# Altium schematic sheet communication.SchDoc
size A3; DocumentNumber: 2; SheetNumber: 2; SheetTotal: 45; SheetDescription: Communication
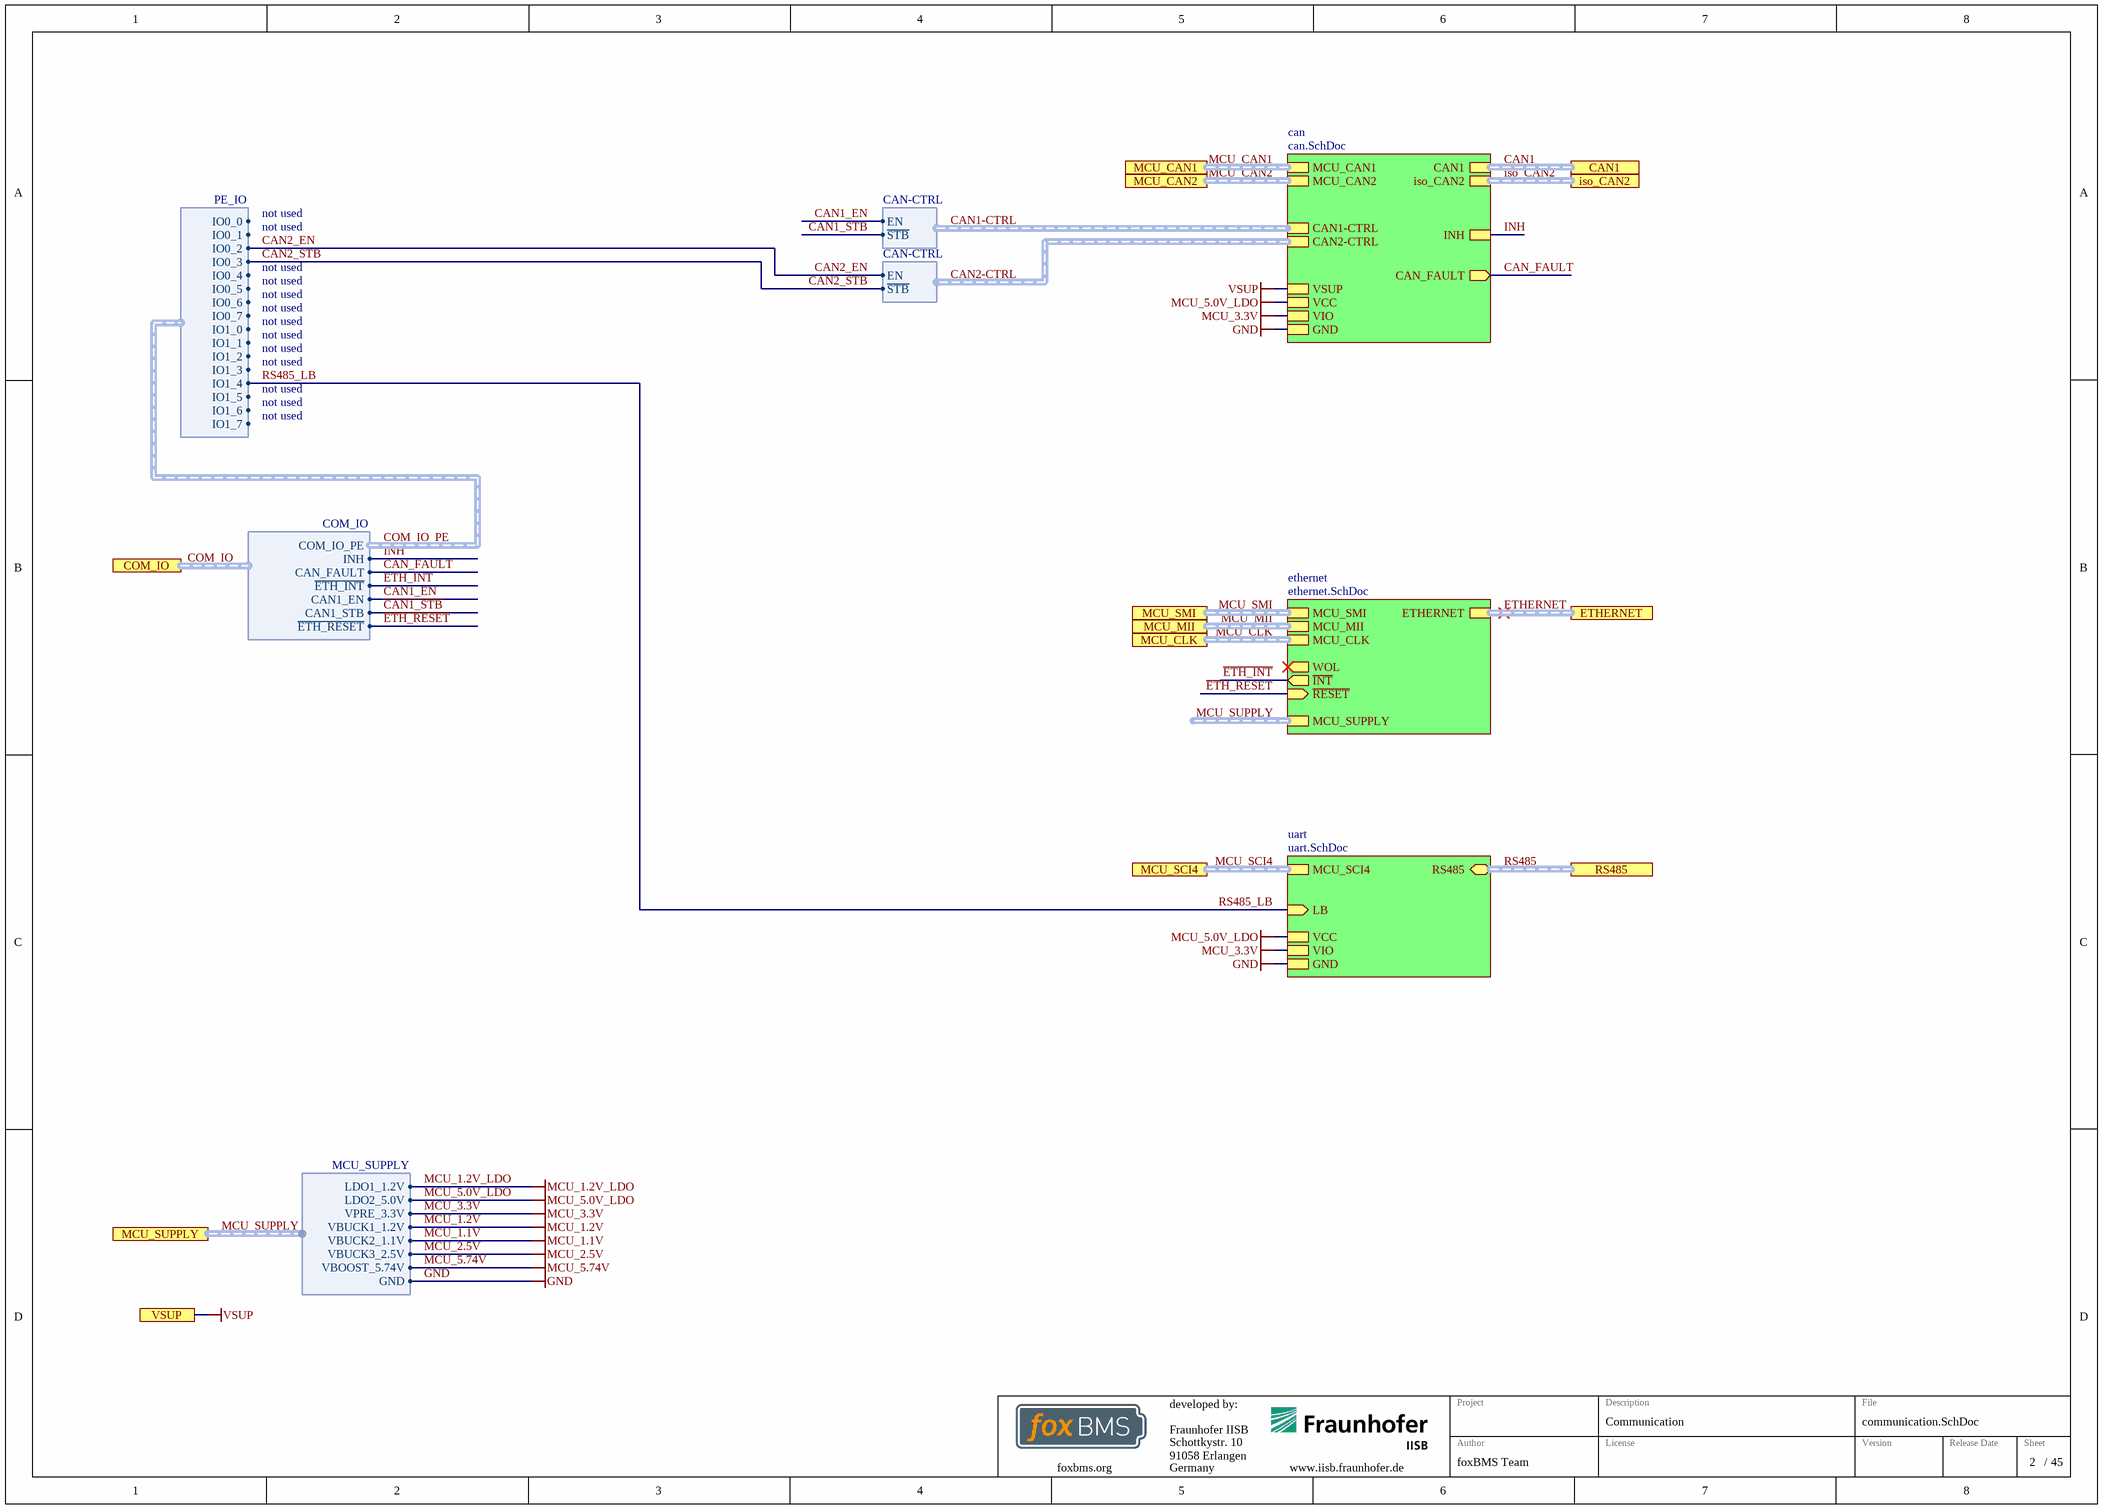
[diagram p0: communication.SchDoc]

## Sub-sheets
can = can.SchDoc: MCU_CAN1 (harness MCU_CAN), CAN2-CTRL (harness CAN-CTRL), CAN1-CTRL (harness CAN-CTRL), MCU_CAN2 (harness MCU_CAN), iso_CAN2 (harness CAN), CAN1 (harness CAN), VCC, GND, VSUP, INH, CAN_FAULT (out), VIO
ethernet = ethernet.SchDoc: MCU_SMI (harness MCU_SMI), WOL (out), MCU_MII (harness MCU_MII), ~{INT} (out), ~{RESET} (in), ETHERNET (harness ETHERNET), MCU_SUPPLY (harness MCU_SUPPLY), MCU_CLK (harness CLOCK)
uart = uart.SchDoc: MCU_SCI4 (harness MCU_SCI), LB (in), VIO, RS485 (bidir, harness RS485), VCC, GND

## Ports
CAN1 (harness CAN), COM_IO (harness COM_IO), ETHERNET (harness ETHERNET), iso_CAN2 (harness CAN), MCU_CAN1 (harness MCU_CAN), MCU_CAN2 (harness MCU_CAN), MCU_CLK (harness CLOCK), MCU_MII (harness MCU_MII), MCU_SCI4 (harness MCU_SCI), MCU_SMI (harness MCU_SMI), MCU_SUPPLY (harness MCU_SUPPLY), RS485 (harness RS485), VSUP

## Harnesses
PE_IO: IO0_0, IO0_1, IO0_2, IO0_3, IO0_4, IO0_5, IO0_6, IO0_7, IO1_0, IO1_1, IO1_2, IO1_3, IO1_4, IO1_5, IO1_6, IO1_7
CAN-CTRL: EN, ~{STB}
COM_IO: COM_IO_PE, CAN_FAULT, ~{ETH_INT}, INH, CAN1_EN, CAN1_STB, ~{ETH_RESET}
MCU_SUPPLY: VBUCK1_1.2V, VBUCK2_1.1V, VBUCK3_2.5V, LDO1_1.2V, LDO2_5.0V, GND, VPRE_3.3V, VBOOST_5.74V

## Nets
GND: sheet can/GND, sheet uart/GND, port MCU_SUPPLY.GND
MCU_1.1V: port MCU_SUPPLY.VBUCK2_1.1V
MCU_1.2V: port MCU_SUPPLY.VBUCK1_1.2V
MCU_1.2V_LDO: port MCU_SUPPLY.LDO1_1.2V
MCU_2.5V: port MCU_SUPPLY.VBUCK3_2.5V
MCU_3.3V: sheet can/VIO, sheet uart/VIO, port MCU_SUPPLY.VPRE_3.3V
MCU_5.0V_LDO: sheet can/VCC, sheet uart/VCC, port MCU_SUPPLY.LDO2_5.0V
MCU_5.74V: port MCU_SUPPLY.VBOOST_5.74V
VSUP: port VSUP, sheet can/VSUP
~{CAN1_STB}: sheet can/CAN1-CTRL.~{STB}, port COM_IO.CAN1_STB
~{CAN2_STB}: harness PE_IO.IO0_3, sheet can/CAN2-CTRL.~{STB}
~{ETH_INT}: sheet ethernet/~{INT}, port COM_IO.~{ETH_INT}
~{ETH_RESET}: sheet ethernet/~{RESET}, port COM_IO.~{ETH_RESET}
CAN1_EN: sheet can/CAN1-CTRL.EN, port COM_IO.CAN1_EN  [project net CAN1-CTRL.EN]
CAN2_EN: harness PE_IO.IO0_2, sheet can/CAN2-CTRL.EN  [project net CAN2-CTRL.EN]
CAN_FAULT: sheet can/CAN_FAULT, port COM_IO.CAN_FAULT
INH: sheet can/INH, port COM_IO.INH  [project net COM_IO.INH]
RS485_LB: sheet uart/LB, harness PE_IO.IO1_4  [project net COM_IO_PE.IO1_4]

## Buses and harness runs
harness CAN1 = port CAN1 = sheet can/CAN1
harness CAN1-CTRL = sheet can/CAN1-CTRL
harness CAN2-CTRL = sheet can/CAN2-CTRL
harness COM_IO = port COM_IO
harness ETHERNET = port ETHERNET = sheet ethernet/ETHERNET
harness iso_CAN2 = port iso_CAN2 = sheet can/iso_CAN2
harness MCU_CAN1 = port MCU_CAN1 = sheet can/MCU_CAN1
harness MCU_CAN2 = port MCU_CAN2 = sheet can/MCU_CAN2
harness MCU_CLK = port MCU_CLK = sheet ethernet/MCU_CLK
harness MCU_MII = port MCU_MII = sheet ethernet/MCU_MII
harness MCU_SCI4 = port MCU_SCI4 = sheet uart/MCU_SCI4
harness MCU_SMI = port MCU_SMI = sheet ethernet/MCU_SMI
harness MCU_SUPPLY = port MCU_SUPPLY
harness MCU_SUPPLY = sheet ethernet/MCU_SUPPLY
harness RS485 = port RS485 = sheet uart/RS485

## Notes on the sheet
- not used
- Fraunhofer IISB
- Schottkystr. 10
- developed by:
- 91058 Erlangen
- Germany
- Author
- Project
- License
- Description
- File
- Version
- Release Date
- Sheet
- foxbms.org <https://foxbms.org>
- www.iisb.fraunhofer.de <https://www.iisb.fraunhofer.de/>
- foxBMS Team
- /